# Altium schematic sheet SolarCharger.SchDoc
size A; SheetNumber: 1; SheetTotal: 1
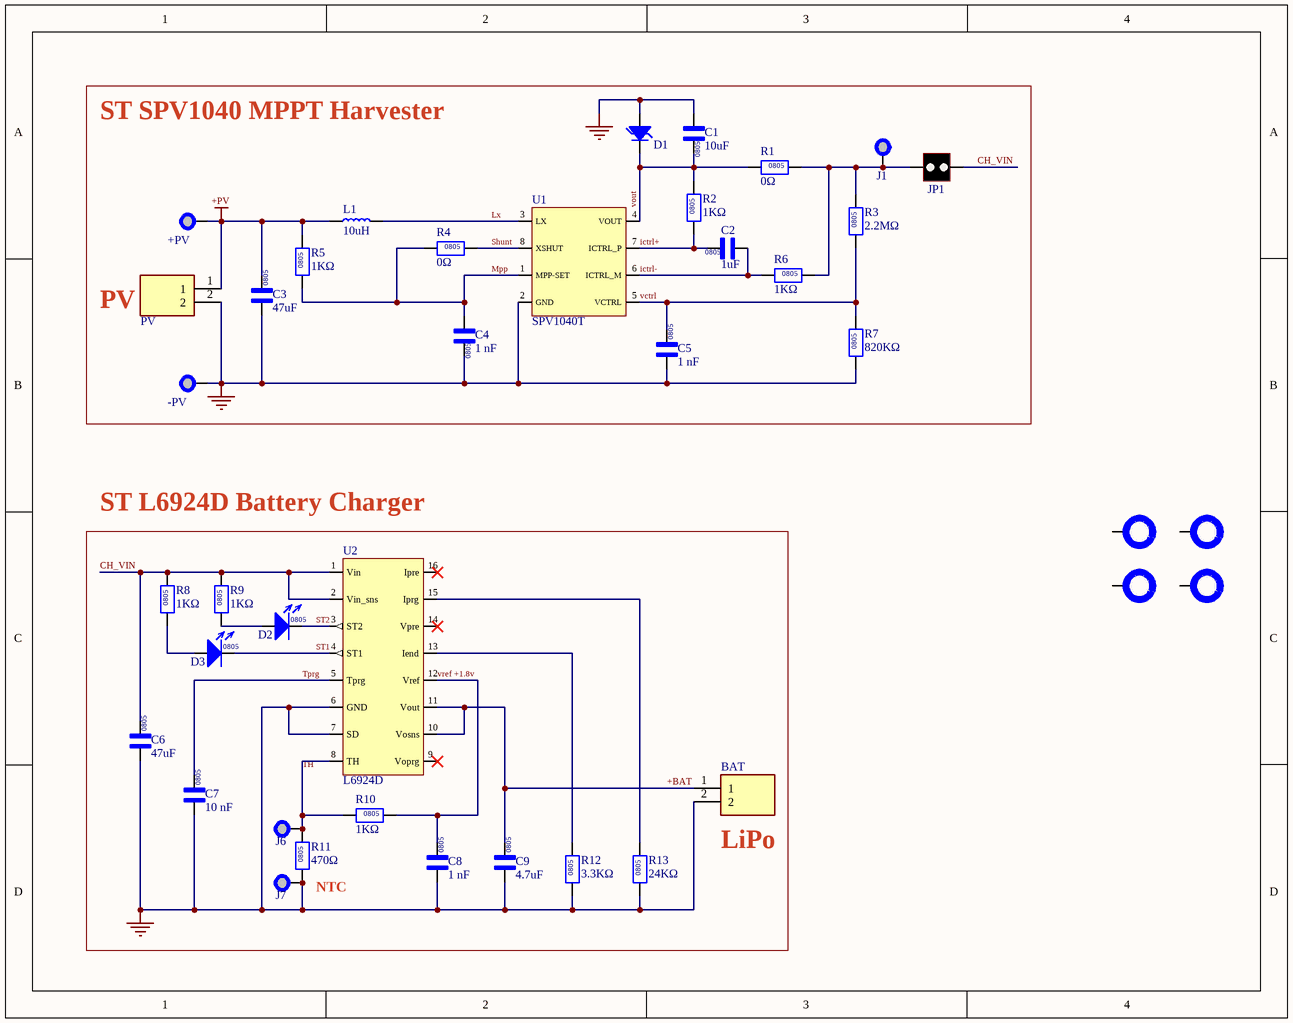
[diagram p0: SolarCharger.SchDoc]

## Parts
+PV  Power Pad  [PAD]  (value not drawn)  (no BOM)
-PV  Power Pad  [PAD]  (value not drawn)  (no BOM)
BAT  640456-2  [TE_640456-2]  (value not drawn)
C1  10uF  Form: 0805  [YAGEO-0805-C-L]
C2  1uF  Form: 0805  [YAGEO-0805-C-L]
C3  47uF  Form: 0805  [YAGEO-0805-C-L]
C4  1 nF  Form: 0805  [YAGEO-0805-C-L]
C5  1 nF  Form: 0805  [YAGEO-0805-C-L]
C6  47uF  Form: 0805  [YAGEO-0805-C-L]
C7  10 nF  Form: 0805  [YAGEO-0805-C-L]
C8  1 nF  Form: 0805  [YAGEO-0805-C-L]
C9  4.7uF  Form: 0805  [YAGEO-0805-C-L]
D1  TVS-MSKSEMI  [MSKSEMI-TVS-L]  (value not drawn)
D2  Form: 0805  [SMD-LED-L]  (hidden comment: SMD LED)
D3  Form: 0805  [SMD-LED-L]  (hidden comment: SMD LED)
J1  Power Pad  [PAD]  (value not drawn)  (no BOM)
J6  Power Pad  [PAD]  (value not drawn)  (no BOM)
J7  Power Pad  [PAD]  (value not drawn)  (no BOM)
JP1  J2P  [DIP2]  (value not drawn)
L1  10uH  [Bead 10uH]
MH1  Mounting Hole  [Mounting Hole]  (value not drawn)  (no BOM)
MH2  Mounting Hole  [Mounting Hole]  (value not drawn)  (no BOM)
MH3  Mounting Hole  [Mounting Hole]  (value not drawn)  (no BOM)
MH4  Mounting Hole  [Mounting Hole]  (value not drawn)  (no BOM)
PV  640456-2  [TE_640456-2]  (value not drawn)
R1  0Ω  Form: 0805  [YAGEO-0805-R-L]
R2  1KΩ  Form: 0805  [YAGEO-0805-R-L]
R3  2.2MΩ  Form: 0805  [YAGEO-0805-R-L]
R4  0Ω  Form: 0805  [YAGEO-0805-R-L]
R5  1KΩ  Form: 0805  [YAGEO-0805-R-L]
R6  1KΩ  Form: 0805  [YAGEO-0805-R-L]
R7  820KΩ  Form: 0805  [YAGEO-0805-R-L]
R8  1KΩ  Form: 0805  [YAGEO-0805-R-L]
R9  1KΩ  Form: 0805  [YAGEO-0805-R-L]
R10  1KΩ  Form: 0805  [YAGEO-0805-R-L]
R11  470Ω  Form: 0805  [YAGEO-0805-R-L]
R12  3.3KΩ  Form: 0805  [YAGEO-0805-R-L]
R13  24KΩ  Form: 0805  [YAGEO-0805-R-L]
U1  SPV1040T  [SOP65P640X120-8N]
U2  L6924D  [QFN50P300X300X100-17L-D]

## Nets
+PV: +PV.1 C3.1 L1.1 PV.1 R5.2
GND: -PV.1 BAT.2 C1.1 C3.2 C4.2 C5.2 C6.2 C7.2 C8.2 C9.2 D1.2 J7.1 PV.2 R7.1 R11.1 R12.1 R13.1 U1.2(GND) U2.6(GND) U2.7(SD)
+BAT: BAT.1 C9.1 U2.10(Vosns) U2.11(Vout)
CH_VIN: C6.1 JP1.2 R8.2 R9.2 U2.1(Vin) U2.2(Vin_sns)
ictrl+: C2.2 R2.1 U1.7(ICTRL_P)
ictrl-: C2.1 R6.1 U1.6(ICTRL_M)
Lx: L1.2 U1.3(LX)
Mpp: C4.1 R4.1 R5.1 U1.1(MPP-SET)
Shunt: R4.2 U1.8(XSHUT)
ST1: D3.2 U2.4(ST1)
ST2: D2.2 U2.3(ST2)
TH: J6.1 R10.1 R11.2 U2.8(TH)
Tprg: C7.1 U2.5(Tprg)
vctrl: C5.1 R3.1 R7.2 U1.5(VCTRL)
vout: C1.2 D1.1 R1.1 R2.2 U1.4(VOUT)
vref +1.8v: C8.1 R10.2 U2.12(Vref)
NetD2_1: D2.1 R9.1
NetD3_1: D3.1 R8.1
NetJ1_1: J1.1 JP1.1 R1.2 R3.2 R6.2
NetR12_2: R12.2 U2.13(Iend)
NetR13_2: R13.2 U2.15(Iprg)

Not connected (* = marked no-connect by the designer): MH1 1; MH2 1; MH3 1; MH4 1; U2 9(Voprg)* 14(Vpre)* 16(Ipre)*

## Notes on the sheet
- ST SPV1040 MPPT Harvester
- PV
- ST L6924D Battery Charger
- NTC
- (near BAT) LiPo

## Library data of the parts
+PV -PV J1 J6 J7 = PAD: Power pad 4mmx1.5mm
BAT PV = 640456-2: 1x2P 1 2.54mm 2 Copper Alloy Plugin,P=2.54mm Wire To Board / Wire To Wire Connector; Manufacturer: TE; Manufacturer Part Number: 640456-2; Supplier: LCSC; Supplier Part Number: C86502; Price: 0.0711; ComponentLink1Description: TE Connector; ComponentLink1URL: https://datasheet.lcsc.com/lcsc/2304140030_TE-Connectivity-640456-2_C86502.pdf
C1 = CC0805KKX5R7BB106: 10 uF, 16 V, ± 10%, X5R, 0805; Manufacturer: Yageo; Manufacturer Part Number: CC0805KKX5R7BB106; ComponentLink5URL: http://www.yageo.com/documents/recent/UPY-GPHC_X5R_4V-to-50V_12.pdf?src-supplier=Avnet; ComponentLink5Description: Yageo Capacitors; Supplier: LCSC; Supplier Part Number: C89827; Price: 0.0419
C2 = CC0805KKX7R6BB105: 1 uF, 10 V, ± 10%, X7R, 0805; Manufacturer: Yageo; Manufacturer Part Number: CC0805KKX7R6BB105; ComponentLink10URL: https://datasheet.lcsc.com/lcsc/2007101233_YAGEO-CC0805KKX7R6BB105_C519973.pdf; ComponentLink10Description: Yageo Capacitors; Supplier: LSCS; Supplier Part Number: C519973; Price: 0.0116
C3 C6 = CL21A476MQYNNNE: 47 uF, 6.3 V, ± 20%, X5R, 0805; Manufacturer: Samsung; Manufacturer Part Number: CL21A476MQYNNNE; ComponentLink1URL: https://datasheet.lcsc.com/lcsc/2304140030_Samsung-Electro-Mechanics-CL21A476MQYNNNE_C16780.pdf; ComponentLink1Description: Samsung SMD Capacitor; Supplier: LCSC; Supplier Part Number: C16780; Price: 0.0273
C4 C5 C8 = CC0805KRX7R9BB102: 1 nF,  50V, 10%, X7R, 0805; Manufacturer: Yageo; Manufacturer Part Number: CC0805KRX7R9BB102; ComponentLink6URL: https://datasheet.lcsc.com/lcsc/1810311439_YAGEO-CC0805KRX7R9BB102_C94121.pdf; ComponentLink6Description: Yageo Capacitors; Supplier: LCSC; Supplier Part Number: C94121; Price: 0.0047
C7 = CC0805KRX7R9BB103: 10 nF, 50 V, ± 10%, X7R, 0805; Manufacturer: Yageo; Manufacturer Part Number: CC0805KRX7R9BB103; ComponentLink5URL: https://datasheet.lcsc.com/lcsc/2304140030_YAGEO-CC0805KRX7R9BB103_C83170.pdf; ComponentLink5Description: Yageo Capacitors; Supplier: LCSC; Supplier Part Number: C83170; Price: 0.0050
C9 = CC0805KKX5R8BB475: 4.7 uF, 50 V, ± 10%, X5R, 0805; Manufacturer: Yageo; Manufacturer Part Number: CC0805KKX5R8BB475; ComponentLink1URL: https://datasheet.lcsc.com/lcsc/2304140030_YAGEO-CC0805KKX5R8BB475_C132173.pdf; ComponentLink1Description: Yageo Capacitors; Supplier: LCSC; Supplier Part Number: C132173; Price: 0.0335
D1 = SMAJ5.0A: TVS 9.2V 6.4V 5V SMA; Manufacturer: MSKSEMI; Manufacturer Part Number: SMAJ5.0A; Supplier: LCSC; Supplier Part Number: C5189780; Price: 0.0220; ComponentLink1Description: MSKSEMI SMAJXXXA; ComponentLink1URL: https://datasheet.lcsc.com/lcsc/2309270936_MSKSEMI-SMAJ5-0A_C5189780.pdf
D2 D3 = SMD LED: 516nm~525nm -30℃~+85℃ Positive post Emerald 120° 80mW 0805; Manufacturer: XINGLIGHT; Manufacturer Part Number: XL-2012UGC; Supplier: LCSC; Supplier Part Number: C965815; Price: 0.0049; ComponentLink1Description: XINGLIGHT SMD LED; ComponentLink1URL: https://datasheet.lcsc.com/lcsc/2211030000_XINGLIGHT-XL-2012UGC_C965815.pdf
JP1 = PH-00218: 2.5mm 3A  2P Straight Square Pins 6mm -40℃~+105℃ 3mm 2.54mm Plugin Black 1x2P Plugin,P=2.54mm Pin Header; Manufacturer: Liasheng; Supplier: LCSC; Supplier Part Number: C2685144; Manufacturer Part Number: PH-00218; ComponentLink1Description: https://datasheet.lcsc.com/lcsc/2106070303_Liansheng-PH-00218_C2685144.pdf; ComponentLink1URL: https://datasheet.lcsc.com/lcsc/2106070303_Liansheng-PH-00218_C2685144.pdf; Price: 0.0109
L1 = VLS5045EX-100M: 10 uH Power Inductor 20% 100KHz Ferrite 2.5A 0.061Ohm; Manufacturer: TDK; Supplier: LCSC; Supplier Part Number: C404485; Manufacturer Part Number: VLS5045EX-100M; Price: 0.1245; ComponentLink1Description: TDK Power Inductor; ComponentLink1URL: https://datasheet.lcsc.com/lcsc/2304140030_TDK-VLS5045EX-100M_C404485.pdf
MH1-MH4 = Mounting Hole: Mounting hole 7.4mm x 3.2mm
R1 R4 = AC0805FR-070RL: 0 Ohm, 1%, 0.125W, 0805; Manufacturer: Yageo; Manufacturer Part Number: AC0805FR-070RL; Supplier: LCSC; Supplier Part Number: C174076; Price: 0.0039; ComponentLink1Description: Yageo Resistros; ComponentLink1URL: https://datasheet.lcsc.com/lcsc/2304140030_YAGEO-AC0805FR-070RL_C174076.pdf
R2 R5 R6 R8-R10 = RC0805FR-071KL: 1 kOhm, ± 1%, 125 mW, 0805; Manufacturer: Yageo; Supplier: LCSC; Supplier Part Number: C95781; Manufacturer Part Number: RC0805FR-071KL; ComponentLink1URL: https://www.yageo.com/upload/media/product/productsearch/datasheet/rchip/PYu-RC_Group_51_RoHS_L_12.pdf; ComponentLink1Description: Yageo Resistors; Price: 0.0022
R3 = RC0805FR-072M2L: 2.2 MOhm, ± 1%, 125 mW, 0805; Manufacturer: Yageo; Supplier: LCSC; Supplier Part Number: C137552; Manufacturer Part Number: RC0805FR-072M2L; Price: 0.0022; ComponentLink1Description: Yageo Resistors; ComponentLink1URL: https://datasheet.lcsc.com/lcsc/2304140030_YAGEO-RC0805FR-072M2L_C137552.pdf
R7 = RC0805FR-07820KL: 820 kOhm, ± 1%, 125 mW, 0805; Manufacturer: Yageo; Supplier: LCSC; Supplier Part Number: C141700; Manufacturer Part Number: RC0805FR-07820KL; ComponentLink1Description: Yageo Resistors; ComponentLink1URL: https://datasheet.lcsc.com/lcsc/2304140030_YAGEO-RC0805FR-07820KL_C141700.pdf; Price: 0.0021
R11 = RC0805FR-07470RL: 470 Ohm, ± 1%, 125 mW, 0805; Manufacturer: Yageo; Supplier: LCSC; Supplier Part Number: C114564; Manufacturer Part Number: RC0805FR-07470RL; ComponentLink1URL: https://datasheet.lcsc.com/lcsc/2304140030_YAGEO-RC0805FR-07470RL_C114564.pdf; ComponentLink1Description: Yageo Resistors; Price: 0.0020
R12 = RC0805FR-073K3L: 3.3 kOhm, ± 1%, 125 mW, 0805; Manufacturer: Yageo; Supplier: LCSC; Supplier Part Number: C114531; Manufacturer Part Number: RC0805FR-073K3L; Price: 0.0023; ComponentLink1Description: Yageo Resistors; ComponentLink1URL: https://datasheet.lcsc.com/lcsc/2304140030_YAGEO-RC0805FR-073K3L_C114531.pdf
R13 = RC0805FR-0724KL: 24 kOhm, ± 1%, 125 mW, 0805; Manufacturer: Yageo; Manufacturer Part Number: RC0805FR-0724KL; Supplier: LCSC; Supplier Part Number: C137562; Price: 0.0020; ComponentLink1Description: Yageo Resistors; ComponentLink1URL: https://datasheet.lcsc.com/lcsc/2304140030_YAGEO-RC0805FR-0724KL_C137562.pdf
U1 = SPV1040T: IC BATTERY CHARGER SOLAR 8TSSOP; Manufacturer: STMicroelectronics; Supplier: Digi-Key; Supplier Part Number: 497-11417-ND; Manufacturer Part Number: SPV1040T; RoHS: Yes; Category: Battery Management; Stock: 1452; Pricing: 1=4.46, 10=4.002, 25=3.784, 100=3.2793, 250=3.11112, 500=2.7916, 1000=2.35437, 2500=2.23665 (USD); ComponentLink1URL: https://datasheet.ciiva.com/15114/getdatasheetpartid-464486-15114755.pdf?src-supplier=Verical; ComponentLink1Description: https://datasheet.ciiva.com/15114/getdatasheetpartid-464486-15114755.pdf?src-supplier=Verical; ComponentLink2URL: https://datasheet.ciiva.com/1932/cd00287506-1932586.pdf?src-supplier=Digi-Key; ComponentLink2Description: https://datasheet.ciiva.com/1932/cd00287506-1932586.pdf?src-supplier=Digi-Key; ComponentLink3URL: https://datasheet.ciiva.com/4878/cd00287506-4878671.pdf?src-supplier=Mouser; ComponentLink3Description: https://datasheet.ciiva.com/4878/cd00287506-4878671.pdf?src-supplier=Mouser
U2 = L6924D: Battery Charger Li-Ion/Li-Pol 30mA 4.1V 16-Pin VFQFPN EP; Manufacturer: STMicroelectronics; Max Supply Voltage: 12V; Min Supply Voltage: 2.5V; Number of Cells: 1; Max Charge Current: 1A; Supplier: Digi-Key; Supplier Part Number: L6924D-ND; Manufacturer Part Number: L6924D; RoHS: Yes; Category: Battery Management; Pricing: 2000=0.9585 (USD); Mounting Technology: Surface Mount; Pins: 16; Min Operating Temperature: -40°C; Max Operating Temperature: 125°C; Series: -; Packaging: Rail/Tube; Package Quantity: 100; Output Voltage: 4.1V; Output Current: 30mA; Length: 3mm; Width: 3mm; Height: 0.88mm; Radiation Hardening: No; Reach SVHC Compliant: No; RoHS Compliant: Yes; ComponentLink1URL: https://datasheet.ciiva.com/15114/getdatasheetpartid-131731-15114450.pdf?src-supplier=Verical; ComponentLink1Description: https://datasheet.ciiva.com/15114/getdatasheetpartid-131731-15114450.pdf?src-supplier=Verical; ComponentLink2URL: https://datasheet.ciiva.com/14632/0900766b80dafbb8-14632423.pdf?src-supplier=Allied+Electronics; ComponentLink2Description: https://datasheet.ciiva.com/14632/0900766b80dafbb8-14632423.pdf?src-supplier=Allied+Electronics; ComponentLink3URL: https://datasheet.ciiva.com/1137/cd00079821-1137146.pdf?src-supplier=Element14; ComponentLink3Description: https://datasheet.ciiva.com/1137/cd00079821-1137146.pdf?src-supplier=Element14; ComponentLink4URL: https://datasheet.ciiva.com/3213/cd00079821-3213355.pdf?src-supplier=Avnet; ComponentLink4Description: https://datasheet.ciiva.com/3213/cd00079821-3213355.pdf?src-supplier=Avnet; ComponentLink5URL: https://datasheet.ciiva.com/1934/cd00079821-1934461.pdf?src-supplier=Digi-Key; ComponentLink5Description: https://datasheet.ciiva.com/1934/cd00079821-1934461.pdf?src-supplier=Digi-Key